# EAGLE design Senior_Design_2 (EAGLE 9.6.0)
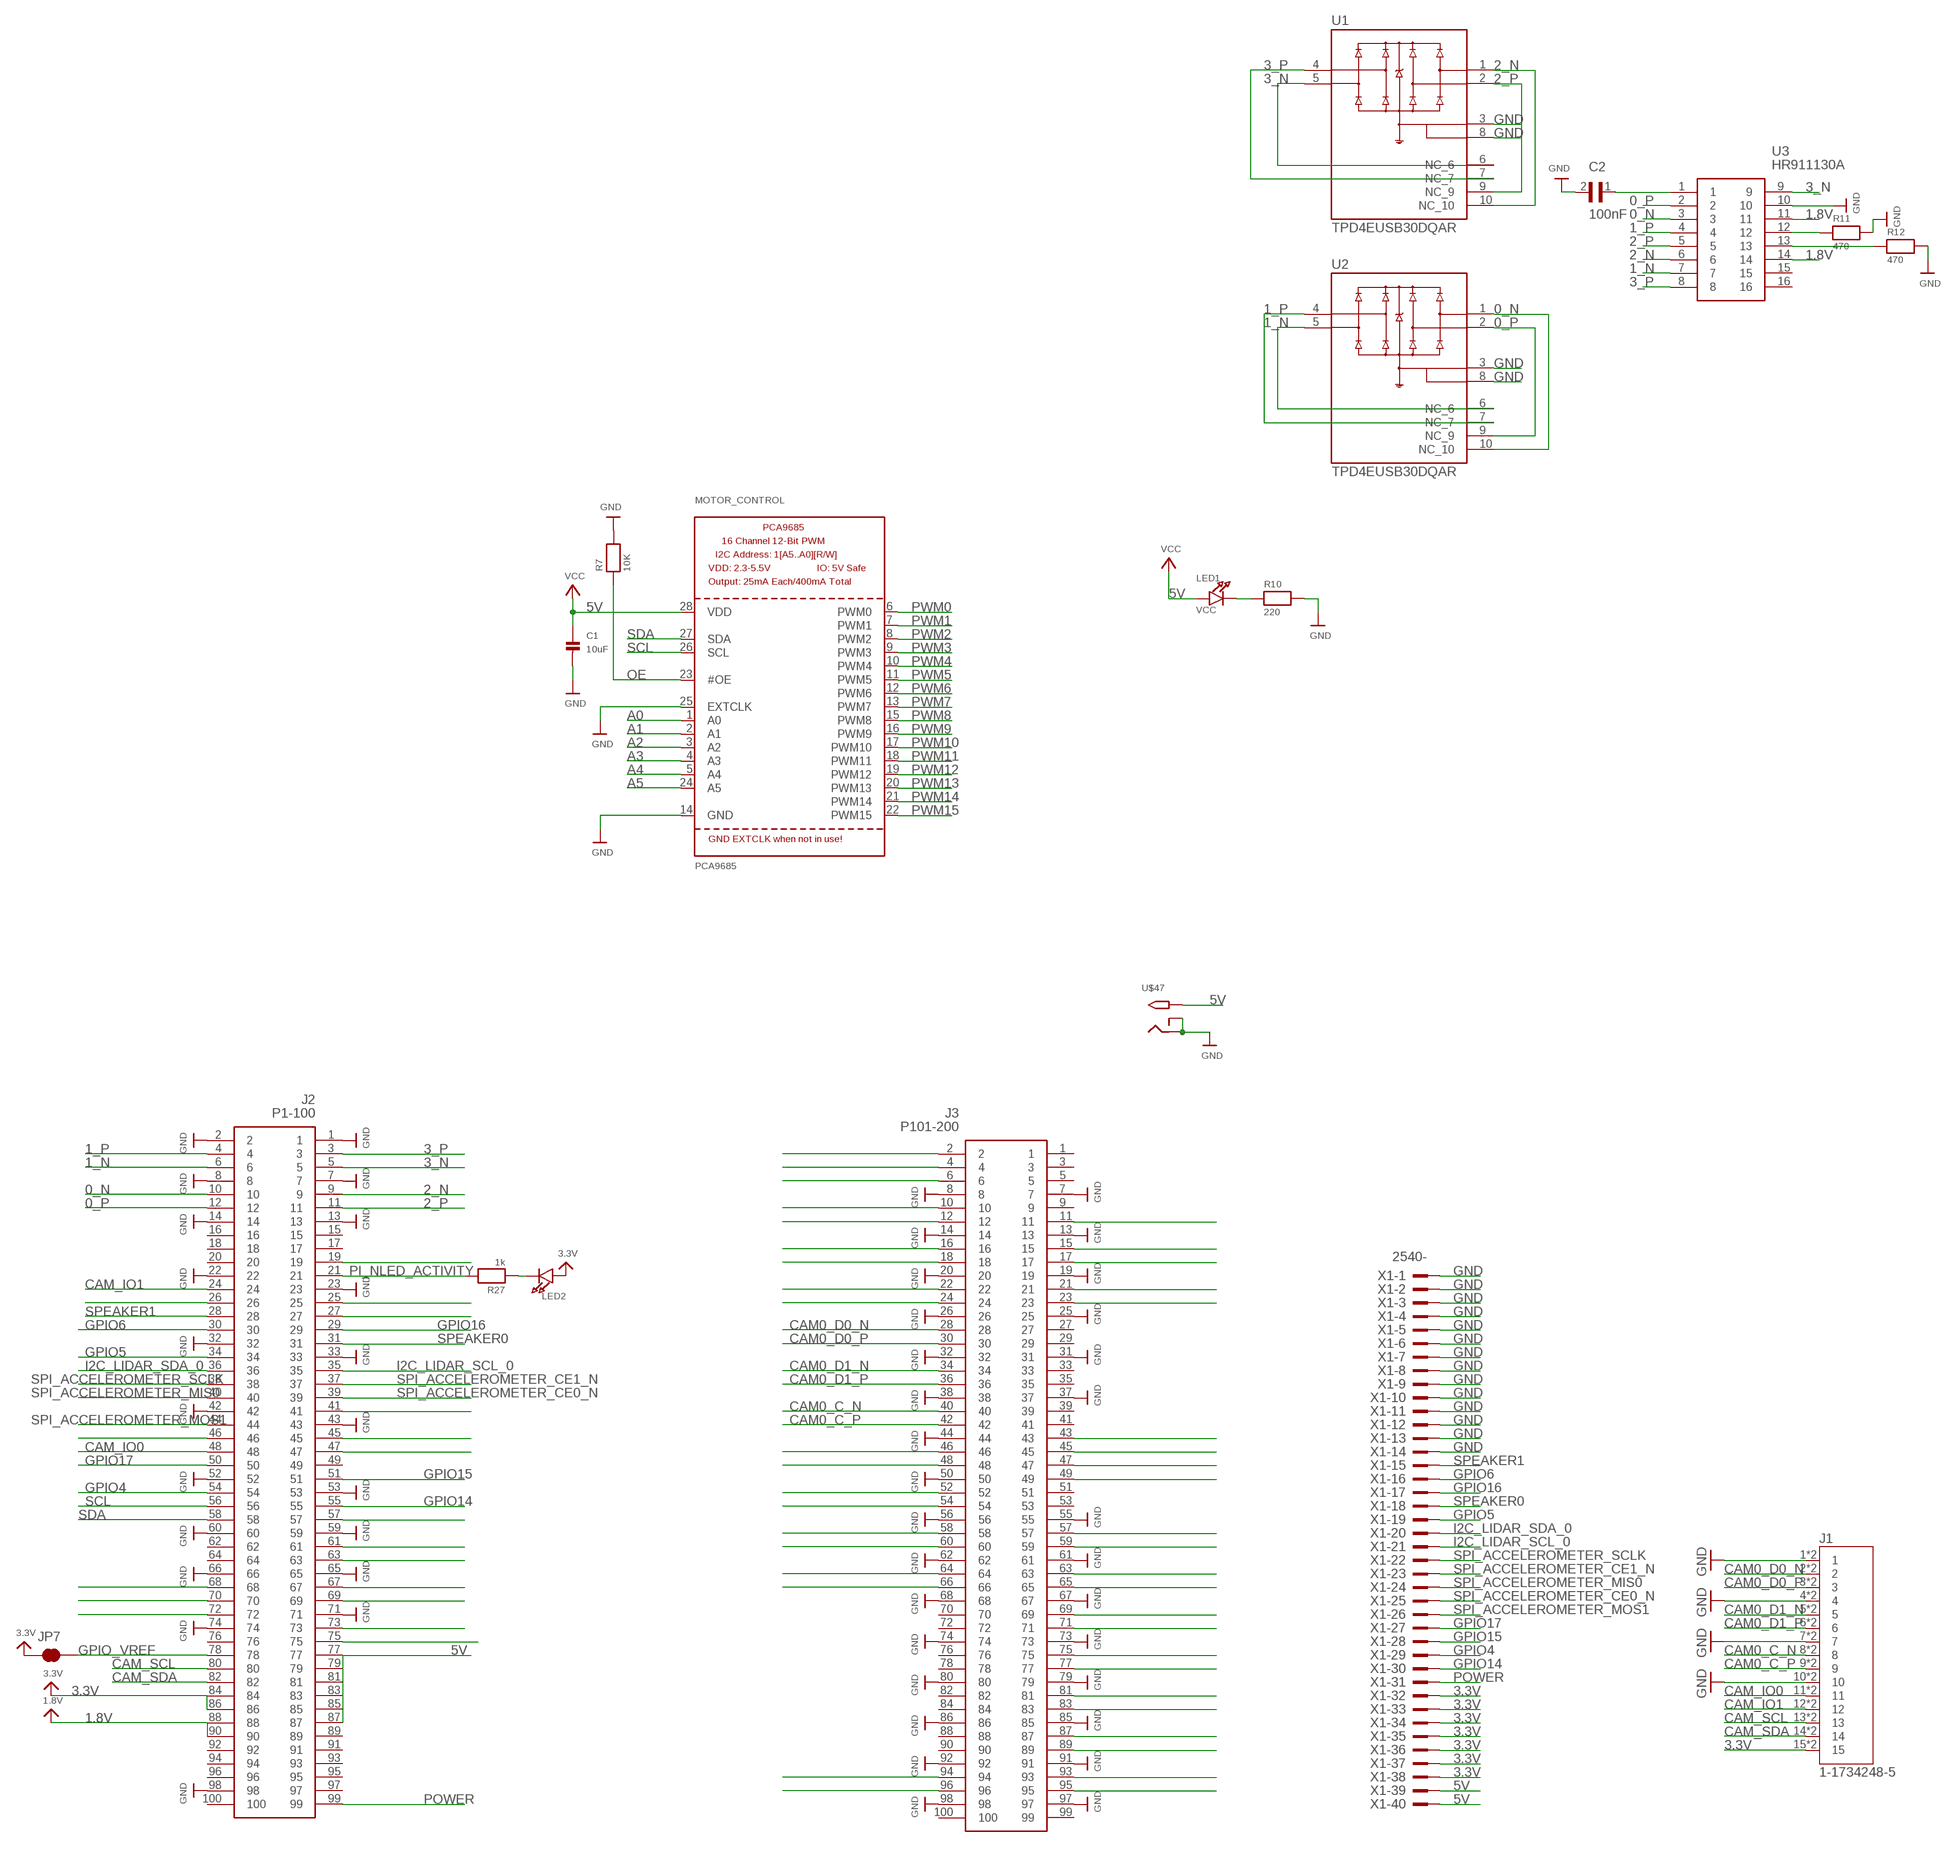
[diagram p0: schematic, sheet 1, part 1 of 2]
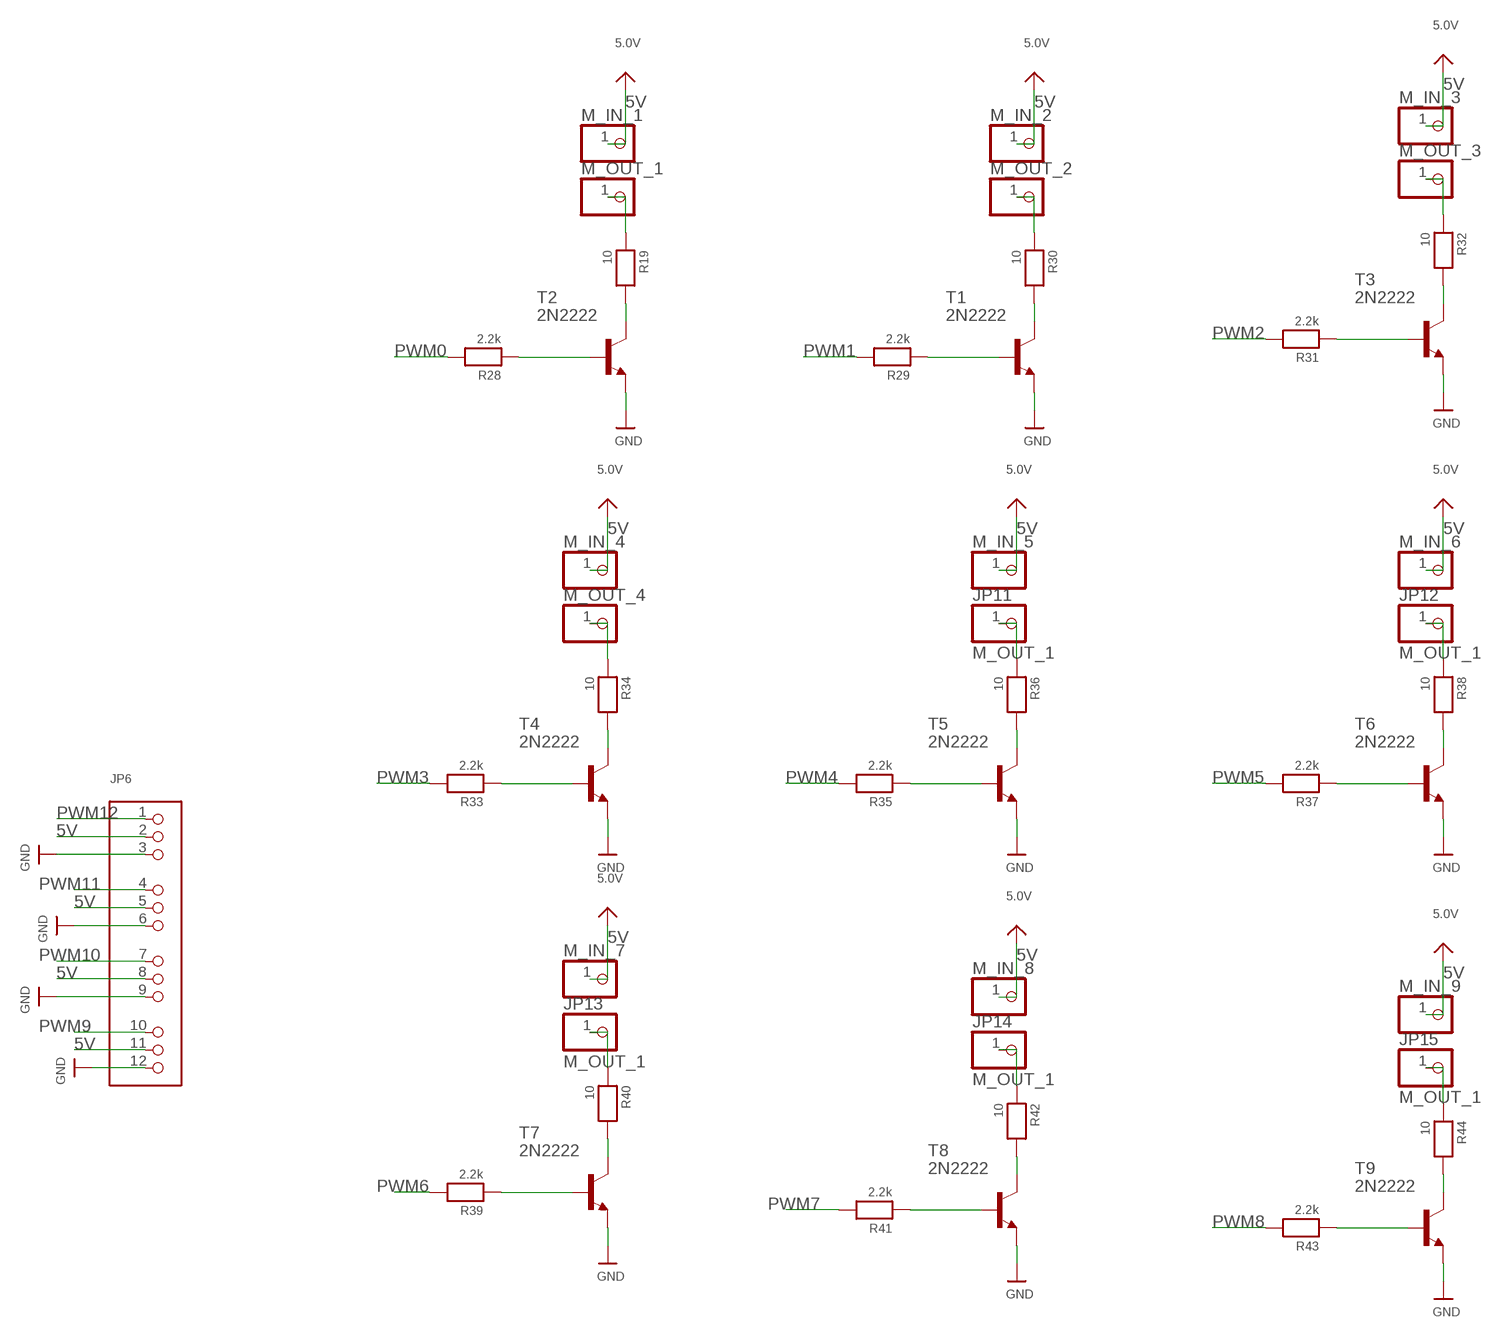
[diagram p1: schematic, sheet 1, part 2 of 2]

## Parts
C1  10uF  CAP_CERAMIC0805  [0805@1]
C2  100nF  CC0603KRX7R9BB104  [CAPC1608X90]
J1  1-1734248-5  [TE_1-1734248-5]
J2  P1-100  DF40C-100DS-0.4V_51_  [DF40C100DS04V51]
J3  P101-200  DF40C-100DS-0.4V_51_  [DF40C100DS04V51]
JP6  HEADER-3X04  [3X04]
JP7  JUMPER-SMT_2_NC_TRACE_NO-SILK  [SMT-JUMPER_2_NC_TRACE_NO-SILK]
JP11  M_OUT_1  PINHD-1X1  [1X01]
JP12  M_OUT_1  PINHD-1X1  [1X01]
JP13  M_OUT_1  PINHD-1X1  [1X01]
JP14  M_OUT_1  PINHD-1X1  [1X01]
JP15  M_OUT_1  PINHD-1X1  [1X01]
LED1  VCC  LED0805  [CHIPLED_0805]
LED2  LED0603  [CHIPLED_0603]
M_IN_1  PINHD-1X1  [1X01]
M_IN_2  PINHD-1X1  [1X01]
M_IN_3  PINHD-1X1  [1X01]
M_IN_4  PINHD-1X1  [1X01]
M_IN_5  PINHD-1X1  [1X01]
M_IN_6  PINHD-1X1  [1X01]
M_IN_7  PINHD-1X1  [1X01]
M_IN_8  PINHD-1X1  [1X01]
M_IN_9  PINHD-1X1  [1X01]
M_OUT_1  PINHD-1X1  [1X01]
M_OUT_2  PINHD-1X1  [1X01]
M_OUT_3  PINHD-1X1  [1X01]
M_OUT_4  PINHD-1X1  [1X01]
MOTOR_CONTROL  PCA9685  [TSSOP28]
R7  10K  RESISTOR0805  [0805]
R10  220  RESISTOR0805  [0805]
R11  470  RESISTOR0805  [0805]
R12  470  RESISTOR0805  [0805]
R19  10  RESISTOR0805  [0805]
R27  1k  RESISTOR0805  [0805]
R28  2.2k  RESISTOR0805  [0805]
R29  2.2k  RESISTOR0805  [0805]
R30  10  RESISTOR0805  [0805]
R31  2.2k  RESISTOR0805  [0805]
R32  10  RESISTOR0805  [0805]
R33  2.2k  RESISTOR0805  [0805]
R34  10  RESISTOR0805  [0805]
R35  2.2k  RESISTOR0805  [0805]
R36  10  RESISTOR0805  [0805]
R37  2.2k  RESISTOR0805  [0805]
R38  10  RESISTOR0805  [0805]
R39  2.2k  RESISTOR0805  [0805]
R40  10  RESISTOR0805  [0805]
R41  2.2k  RESISTOR0805  [0805]
R42  10  RESISTOR0805  [0805]
R43  2.2k  RESISTOR0805  [0805]
R44  10  RESISTOR0805  [0805]
T1  2N2222  [TO92-EBC-OVAL]
T2  2N2222  [TO92-EBC-OVAL]
T3  2N2222  [TO92-EBC-OVAL]
T4  2N2222  [TO92-EBC-OVAL]
T5  2N2222  [TO92-EBC-OVAL]
T6  2N2222  [TO92-EBC-OVAL]
T7  2N2222  [TO92-EBC-OVAL]
T8  2N2222  [TO92-EBC-OVAL]
T9  2N2222  [TO92-EBC-OVAL]
U1  TPD4EUSB30DQAR  [IC_TPD4EUSB30DQAR]
U2  TPD4EUSB30DQAR  [IC_TPD4EUSB30DQAR]
U3  HR911130A  [HR911130A]
U$47  2.1MMJACKTHM  [PJ-102A]
X1  2540-  [PAK100/2500-40]

## Nets
0_N: J2.10 U2.1(D1+) U2.10(NC_10) U3.3
0_P: J2.12 U2.2(D1-) U2.9(NC_9) U3.2
1.8V: J2.88 J2.90 U3.11 U3.14
1_N: J2.6 U2.5(D2-) U2.6(NC_6) U3.7
1_P: J2.4 U2.4(D2+) U2.7(NC_7) U3.4
2_N: J2.9 U1.1(D1+) U1.10(NC_10) U3.6
2_P: J2.11 U1.2(D1-) U1.9(NC_9) U3.5
3.3V: J1.15 J1.15_1 J2.84 J2.86 JP7.1 LED2.A X1.32 X1.33 X1.34 X1.35 X1.36 X1.37 X1.38
3_N: J2.5 U1.5(D2-) U1.6(NC_6) U3.9
3_P: J2.3 U1.4(D2+) U1.7(NC_7) U3.8
5V: C1.1 J2.77 J2.79 J2.81 J2.83 J2.85 J2.87 JP6.2 JP6.5 JP6.8 JP6.11 LED1.A M_IN_1.1 M_IN_2.1 M_IN_3.1 M_IN_4.1 M_IN_5.1 M_IN_6.1 M_IN_7.1 M_IN_8.1 M_IN_9.1 MOTOR_CONTROL.28(VDD) U$47.TIP X1.39 X1.40 ; supply symbol labelled VCC, 5.0V
A0: MOTOR_CONTROL.1(A0)
A1: MOTOR_CONTROL.2(A1)
A2: MOTOR_CONTROL.3(A2)
A3: MOTOR_CONTROL.4(A3)
A4: MOTOR_CONTROL.5(A4)
A5: MOTOR_CONTROL.24(A5)
CAM0_C_N: J1.8 J1.8_1 J3.40
CAM0_C_P: J1.9 J1.9_1 J3.42
CAM0_D0_N: J1.2 J1.2_1 J3.28
CAM0_D0_P: J1.3 J1.3_1 J3.30
CAM0_D1_N: J1.5 J1.5_1 J3.34
CAM0_D1_P: J1.6 J1.6_1 J3.36
CAM_IO0 [CAMIO]: J1.11 J1.11_1 J2.48
CAM_IO1 [CAMIO]: J1.12 J1.12_1 J2.24
CAM_SCL: J1.13 J1.13_1 J2.80
CAM_SDA: J1.14 J1.14_1 J2.82
GND: C1.2 C2.2 J1.1 J1.1_1 J1.4 J1.4_1 J1.7 J1.7_1 J1.10 J1.10_1 J2.1 J2.2 J2.7 J2.8 J2.13 J2.14 J2.22 J2.23 J2.32 J2.33 J2.42 J2.43 J2.52 J2.53 J2.59 J2.60 J2.65 J2.66 J2.71 J2.74 J2.98 J3.7 J3.8 J3.13 J3.14 J3.19 J3.20 J3.25 J3.26 J3.31 J3.32 J3.37 J3.38 J3.44 J3.50 J3.55 J3.56 J3.61 J3.62 J3.67 J3.68 J3.73 J3.74 J3.79 J3.80 J3.85 J3.86 J3.91 J3.92 J3.97 J3.98 JP6.3 JP6.6 JP6.9 JP6.12 MOTOR_CONTROL.14(GND) MOTOR_CONTROL.25(EXTCLK) R7.2 R10.2 R11.2 R12.2 T1.E T2.E T3.E T4.E T5.E T6.E T7.E T8.E T9.E U1.3(GND_3) U1.8(GND_8) U2.3(GND_3) U2.8(GND_8) U3.10 U$47.RING U$47.RING_SW X1.1 X1.2 X1.3 X1.4 X1.5 X1.6 X1.7 X1.8 X1.9 X1.10 X1.11 X1.12 X1.13 X1.14
GPIO4: J2.54 X1.29
GPIO5: J2.34 X1.19
GPIO6: J2.30 X1.16
GPIO14: J2.55 X1.30
GPIO15: J2.51 X1.28
GPIO16: J2.29 X1.17
GPIO17: J2.50 X1.27
GPIO_VREF: J2.78 JP7.2
I2C_LIDAR_SCL_0: J2.35 X1.21
I2C_LIDAR_SDA_0: J2.36 X1.20
N$1: LED1.C R10.1
N$2: C2.1 U3.1
N$3: R11.1 U3.12
N$4: R12.1 U3.13
N$17: R19.2 T2.C
N$18: LED2.C R27.1
N$19: J2.19
N$20: J3.2
N$21: J3.4
N$22: J3.6
N$23: R28.1 T2.B
N$24: J3.10
N$25: J2.25
N$26: J3.11
N$27: J2.27
N$28: J3.12
N$31: J3.15
N$32: J3.16
N$33: J3.17
N$34: M_OUT_1.1 R19.1
N$35: J3.18
N$36: J3.21
N$37: J3.22
N$38: R29.1 T1.B
N$39: R30.2 T1.C
N$40: M_OUT_2.1 R30.1
N$41: J2.41
N$42: J3.23
N$43: J3.24
N$44: R31.1 T3.B
N$45: J2.45
N$46: J2.46
N$47: J2.47
N$48: R32.2 T3.C
N$49: M_OUT_3.1 R32.1
N$50: R33.1 T4.B
N$51: R34.2 T4.C
N$52: M_OUT_4.1 R34.1
N$54: R35.1 T5.B
N$55: R36.2 T5.C
N$56: J2.57
N$57: JP11.1 R36.1
N$58: R37.1 T6.B
N$59: R38.2 T6.C
N$61: JP12.1 R38.1
N$63: R39.1 T7.B
N$66: R40.2 T7.C
N$68: J2.68
N$70: J2.70
N$72: J2.72
N$73: JP13.1 R40.1
N$74: R41.1 T8.B
N$76: R42.2 T8.C
N$78: J3.43
N$81: J3.45
N$82: JP14.1 R42.1
N$83: J3.46
N$84: J3.47
N$85: J3.48
N$86: J3.49
N$89: R43.1 T9.B
N$90: J3.52
N$91: R44.2 T9.C
N$93: J3.54
N$94: JP15.1 R44.1
N$99: J3.57
N$100: J3.58
N$101: J3.59
N$102: J3.60
N$105: J3.63
N$106: J3.64
N$107: J3.65
N$108: J3.66
N$110: J2.75
N$111: J3.69
N$112: J2.73
N$113: J3.71
N$114: J2.67
N$115: J2.69
N$116: J2.63
N$117: J3.75
N$118: J2.61
N$119: J3.77
N$121: J2.26
N$123: J3.81
N$125: J3.83
N$129: J3.87
N$131: J3.89
N$135: J3.93
N$136: J3.94
N$137: J3.95
N$138: J3.96
OE: MOTOR_CONTROL.23(#OE) R7.1
PI_NLED_ACTIVITY: J2.21 R27.2
POWER: J2.99 X1.31
PWM0: MOTOR_CONTROL.6(PWM0) R28.2
PWM1: MOTOR_CONTROL.7(PWM1) R29.2
PWM2: MOTOR_CONTROL.8(PWM2) R31.2
PWM3: MOTOR_CONTROL.9(PWM3) R33.2
PWM4: MOTOR_CONTROL.10(PWM4) R35.2
PWM5: MOTOR_CONTROL.11(PWM5) R37.2
PWM6: MOTOR_CONTROL.12(PWM6) R39.2
PWM7: MOTOR_CONTROL.13(PWM7) R41.2
PWM8: MOTOR_CONTROL.15(PWM8) R43.2
PWM9: JP6.10 MOTOR_CONTROL.16(PWM9)
PWM10: JP6.7 MOTOR_CONTROL.17(PWM10)
PWM11: JP6.4 MOTOR_CONTROL.18(PWM11)
PWM12: JP6.1 MOTOR_CONTROL.19(PWM12)
PWM13: MOTOR_CONTROL.20(PWM13)
PWM14: MOTOR_CONTROL.21(PWM14)
PWM15: MOTOR_CONTROL.22(PWM15)
SCL: J2.56 MOTOR_CONTROL.26(SCL)
SDA: J2.58 MOTOR_CONTROL.27(SDA)
SPEAKER0: J2.31 X1.18
SPEAKER1: J2.28 X1.15
SPI_ACCELEROMETER_CE0_N: J2.39 X1.25
SPI_ACCELEROMETER_CE1_N: J2.37 X1.23
SPI_ACCELEROMETER_MIS0: J2.40 X1.24
SPI_ACCELEROMETER_MOS1: J2.44 X1.26
SPI_ACCELEROMETER_SCLK: J2.38 X1.22
Unconnected: J2.15 J2.16 J2.17 J2.18 J2.20 J2.49 J2.62 J2.64 J2.76 J2.89 J2.91 J2.92 J2.93 J2.94 J2.95 J2.96 J2.97 J2.100 J3.1 J3.3 J3.5 J3.9 J3.27 J3.29 J3.33 J3.35 J3.39 J3.41 J3.51 J3.53 J3.70 J3.72 J3.76 J3.78 J3.82 J3.84 J3.88 J3.90 J3.99 J3.100 U3.15 U3.16

## Library data of the parts
C1 = microbuilder:CAP_CERAMIC: Ceramic Capacitors 0402 - 0402 Surface Mount Capacitors 16pF 50V 5% [Digikey: 445-4899-2-ND] 18pF 50V 5% [Digikey: 490-1281-2-ND] 22pF 50V 5% [Digikey: 490-1283-2-ND] 68pF 50V 5% [Digikey: 490-1289-2-ND] 0.1uF 10V 10% [Digikey: 490-1318-2-ND] 1.0uF 6.3V 10% [Digikey: 490-1320-2-ND] 0603 - 0603 Surface Mount Capacitors 16 pF 50V 5% [Digikey: 445-5051-2-ND] 22 pF 50V [Digikey: PCC220ACVTR-ND] 33 pF 50V 5% [Digikey: 490-1415-1-ND] 56pF 50V 5% [Digikey: 490-1421-1-ND] 220pF 50V 5% [Digikey: 445-1285-1-ND] 680 pF 50V 2200 pF 50V 5% C0G [Digikey: 445-1297-1-ND] 5600 pF 100V 5% X7R [Digikey: 478-3711-1-ND] 0.1 µF 25V 10% [Digikey: PCC2277TR-ND] 0.22 µF 16V 10% X7R [Digikey: 445-1318-1-ND] 1.0 µF 25V 10% [Digikey: 445-5146-2-ND] 0603 - RF Specific 3pF 250V +/-0.1pF RF [Digikey: 712-1347-1-ND] 18 pF 250V 5% [Digikey: 478-3505-1-ND or 712-1322-1-ND] 56 pF 250V 5% C0G RF [Digikey: 490-4867-1-ND] 68 pF 250V RF [Digikey: 490-4868-1-ND] 0805 - 0805 Surface Mount Capacitors 220 pF 250V 2% RF Ceramic Capacitor [Digikey: 712-1398-1-ND] 1000 pF 50V 2% NP0 Ceramic Capacitor [Digikey: 478-3760-1-ND] 0.1 µF 25V 10% Ceramic Capacitor [Digikey: PCC1828TR-ND] 1.0 µF 16V 10% Ceramic Capacitor[Digikey: 490-1691-2-ND] 10.0 µF 10V 10% Ceramic Capacitor[Digikey: 709-1228-1-ND] 10.0 uF 16V 10% Ceramic Capacitor [Digikey: 478-5165-2-ND] 47 uF 6.3V 20% Ceramic Capacitor [Digikey: 587-1779-1-ND or 399-5506-1-ND] 1206 - 1206 Surface Mount Capacitors 47uF 10V 20% Ceramic Capacitor [Digikey: 490-5528-1-ND or 399-5508-1-ND or 445-6010-1-ND] 100uF 6.3V -20%, +80% Y5V Ceramic Capacitor (Digikey: 490-4512-1-ND, Mouser: 81-GRM31CF50J107ZE1L)
C2 = CC0603KRX7R9BB104:CC0603KRX7R9BB104: CAPACITOR, 0603, 100NF, 50V, X7R; Dielectric Characteristic:X7R; Capacitance:100000pF; Capacitance Tolerance:± 10%; Voltage Rating:50V; Temperature Coefficient:± 15%; Capacitor Case Style:0603; No. of Pins:2; Mounting Type:SMD; Operating Temperature Range:-55°C to +125°C; SVHC:No SVHC; Application:Standard; Capacitor Dielectric Type:Multilayer Ceramic; Case Style:0603; Max Operating Temperature:125°C; Min Temperature Operating:-55°C; Terminal Type:Surface Mount (SMD, SMT); Termination Type:SMD; Tolerance, +:10%; Tolerance, -:10%; Voltage Rating DC:50V Check availability <https://pricing.snapeda.com/parts/CC0603KRX7R9BB104/Yageo/view-part?ref=eda>; AVAILABILITY: In Stock; DESCRIPTION: 0.1 µF ±10% 50V Ceramic Capacitor X7R 0603 (1608 Metric); MF: Yageo; MP: CC0603KRX7R9BB104; PACKAGE: 0603 Yageo; PRICE: None; PURCHASE-URL: https://pricing.snapeda.com/search/part/CC0603KRX7R9BB104/?ref=eda
J1 = 1-1734248-5:1-1734248-5: CONN FPC VERT 15POS 1.00MM SMD; COMMENT: 1-1734248-5; DESCRIPTION: FPC CONNECTOR, RECEPTACLE 15POS 1MMPITCH; Series:FPC; Gender:Receptacle; Pitch S; DIGI-KEY_PART_NUMBER: A101418TR-ND; MF: TE Connectivity; MP: 1-1734248-5; PACKAGE: None; PURCHASE-URL: https://pricing.snapeda.com/search/part/1-1734248-5/?ref=eda
J2 = SamacSys_Parts:DF40C-100DS-0.4V_51_: HIROSE(HRS) - DF40C-100DS-0.4V(51) - CONNECTOR, STACKING, RCPT, 100POS, 2ROW Source: Datasheet <https://www.hirose.com/product/en/download_file/key_name/DF40C-100DS-0.4V(51)/category/Drawing (2D)/doc_file_id/46856/?file_category_id=6&item_id=06844033451&is_series=>; DESCRIPTION: HIROSE(HRS) - DF40C-100DS-0.4V(51) - CONNECTOR, STACKING, RCPT, 100POS, 2ROW; HEIGHT: 1.65mm; MANUFACTURER_NAME: Hirose; MANUFACTURER_PART_NUMBER: DF40C-100DS-0.4V(51); MF: VISHAY; MOUSER_PART_NUMBER: 798-DF40C100DS0.4V51; MOUSER_PRICE-STOCK: https://www.mouser.co.uk/ProductDetail/Hirose-Connector/DF40C-100DS-04V51?qs=eDUdFcBPps2MEwbnuPvZzQ%3D%3D; MPN: MCW0406MD1003BP100; OC_NEWARK: 31W9017
J3 = SamacSys_Parts:DF40C-100DS-0.4V_51_: HIROSE(HRS) - DF40C-100DS-0.4V(51) - CONNECTOR, STACKING, RCPT, 100POS, 2ROW Source: Datasheet <https://www.hirose.com/product/en/download_file/key_name/DF40C-100DS-0.4V(51)/category/Drawing (2D)/doc_file_id/46856/?file_category_id=6&item_id=06844033451&is_series=>; DESCRIPTION: HIROSE(HRS) - DF40C-100DS-0.4V(51) - CONNECTOR, STACKING, RCPT, 100POS, 2ROW; HEIGHT: 1.65mm; MANUFACTURER_NAME: Hirose; MANUFACTURER_PART_NUMBER: DF40C-100DS-0.4V(51); MOUSER_PART_NUMBER: 798-DF40C100DS0.4V51; MOUSER_PRICE-STOCK: https://www.mouser.co.uk/ProductDetail/Hirose-Connector/DF40C-100DS-04V51?qs=eDUdFcBPps2MEwbnuPvZzQ%3D%3D; OC_NEWARK: unknown
JP6 = microbuilder:HEADER-3X04
JP7 = SparkFun-Jumpers:JUMPER-SMT_2_NC_TRACE: Normally closed trace jumper This jumper has a trace between two pads so it's normally closed (NC). Use a razor knife to open the connection. For best results follow the IPC guidelines for cutting traces: Cutout at least 0.063 mm (0.005 in). Remove all loose material to clean up the cut area. Seal the cut with an approved epoxy. Reapply solder to reclose the connection.; OC_NEWARK: unknown
JP11-JP15 M_IN_1-M_IN_9 M_OUT_1-M_OUT_4 = pinhead:PINHD-1X1: PIN HEADER
LED1 = microbuilder:LED: LED 0603 - 0603 Surface Mount Package 2mA: Green LED - Low Power (3.9mcd, 2ma, 1.7Vf) - Digikey: 475-2709-2-ND Orange LED - Low Power (9.8mcd, 2ma, 1.8Vf) - Digikey: 475-1194-2-ND Red LED - Low Power (5mcd, 2ma, 1.8Vf) - Digikey: 475-1195-2-ND Yellow LED - Low Power (7mcd, 2ma, 1.8Vf) - Digikey: 475-1196-2-ND 5mA: Blue LED - Low Power (17mcd, 5ma, 2.9Vf) - Digikey: LNJ937W8CRACT-ND 0805 - 0805 Surface Mount Package 2mA: Red LED (8.8mcd, 2mA, 1.8Vf, Clear) - Low Power [Digikey: 475-2510-1-ND] Green LED (5mcd, 2mA, 1.8Vf, Clear) - Low Power [Digikey: 475-2730-1-ND] Yellow LED (11.3mcd, 2mA, 1.8Vf, Clear) - Low Power [Digikey: 475-2555-1-ND] 20mA: Red LED (104mcd, 20mA, Diffused) - LS R976 [Digikey: 475-1278-6-ND] Red LED (12mcd, 20mA, 2.0Vf, Clear) - APT2012EC [Digikey: 754-1128-1-ND] Green LED (15mcd, 20mA, 2.2Vf, Clear) - APT2012GC [Digikey: 754-1131-1-ND] Orange LED (160mcd, 20mA, 2.1Vf, Clear) - APT2012SECK [Digikey: 754-1130-1-ND] 1206 - 1206 Surface Mount Package Green LED (26mcd, 20mA, Diffused) - LG N971 [Digikey: 475-1407-6-ND] Red LED (15mcd, 20mA, Diffused) - LH N974 [Digikey: 475-1416-6-ND]
LED2 = microbuilder:LED: LED 0603 - 0603 Surface Mount Package 2mA: Green LED - Low Power (3.9mcd, 2ma, 1.7Vf) - Digikey: 475-2709-2-ND Orange LED - Low Power (9.8mcd, 2ma, 1.8Vf) - Digikey: 475-1194-2-ND Red LED - Low Power (5mcd, 2ma, 1.8Vf) - Digikey: 475-1195-2-ND Yellow LED - Low Power (7mcd, 2ma, 1.8Vf) - Digikey: 475-1196-2-ND 5mA: Blue LED - Low Power (17mcd, 5ma, 2.9Vf) - Digikey: LNJ937W8CRACT-ND 0805 - 0805 Surface Mount Package 2mA: Red LED (8.8mcd, 2mA, 1.8Vf, Clear) - Low Power [Digikey: 475-2510-1-ND] Green LED (5mcd, 2mA, 1.8Vf, Clear) - Low Power [Digikey: 475-2730-1-ND] Yellow LED (11.3mcd, 2mA, 1.8Vf, Clear) - Low Power [Digikey: 475-2555-1-ND] 20mA: Red LED (104mcd, 20mA, Diffused) - LS R976 [Digikey: 475-1278-6-ND] Red LED (12mcd, 20mA, 2.0Vf, Clear) - APT2012EC [Digikey: 754-1128-1-ND] Green LED (15mcd, 20mA, 2.2Vf, Clear) - APT2012GC [Digikey: 754-1131-1-ND] Orange LED (160mcd, 20mA, 2.1Vf, Clear) - APT2012SECK [Digikey: 754-1130-1-ND] 1206 - 1206 Surface Mount Package Green LED (26mcd, 20mA, Diffused) - LG N971 [Digikey: 475-1407-6-ND] Red LED (15mcd, 20mA, Diffused) - LH N974 [Digikey: 475-1416-6-ND]; MF: OSRAM; MPN: LS Q976-NR-1; OC_NEWARK: 32AC1319
MOTOR_CONTROL = microbuilder:PCA9685: PCA9685 - 16 Channel 12-Bit I2C PWM Controller 5.0V tolerant 16 channel, 12-bit I2C PWM controller with 25mA per output (max. 400mA total) Digikey: 568-5931-1-ND
R7 R10-R12 R19 R27-R44 = microbuilder:RESISTOR: Resistors For new designs, use the packages preceded by an '_' character since they are more reliable: The following footprints should be used on most boards: _0402 - Standard footprint for regular board layouts _0603 - Standard footprint for regular board layouts _0805 - Standard footprint for regular board layouts For extremely tight-pitch boards where space is at a premium, the following 'micro-pitch' footprints can be used (smaller pads, no silkscreen outline, etc.): _0402MP - Micro-pitch footprint for very dense/compact boards _0603MP - Micro-pitch footprint for very dense/compact boards _0805MP - Micro-pitch footprint for very dense/compact boards
T1-T9 = adafruit:2N2222: NPN TRANSISTOR Big oval pads
U1 U2 = TPD4EUSB30DQAR:TPD4EUSB30DQAR: 4-channel ESD solution for SuperSpeed (6 Gbps) USB 3.0 interface 10-USON -40 to 85 Check availability <https://pricing.snapeda.com/parts/TPD4EUSB30DQAR/Texas%20Instruments/view-part?ref=eda>; AVAILABILITY: In Stock; DESCRIPTION: Quad 0.8-pF, 5.5-V, ±8-kV ESD protection diode with 5-A 8/20-uS surge rating for USB 3.0; MF: Texas Instruments; MP: TPD4EUSB30DQAR; PACKAGE: USON-10 Texas Instruments; PRICE: None; PURCHASE-URL: https://pricing.snapeda.com/search/part/TPD4EUSB30DQAR/?ref=eda
U3 = HR911130A:HR911130A: SINGLE PORT RJ45 CONNECTOR WITH INTEGRATED MAGNETICS AND LED Source: Datasheet <https://datasheet.lcsc.com/szlcsc/Zhongshan-HanRun-Elec-HR911130A_C54408.pdf>; DESCRIPTION: SINGLE PORT RJ45 CONNECTOR WITH INTEGRATED MAGNETICS AND LED; HEIGHT: 13mm; MANUFACTURER_NAME: Hanrun Electronics; MANUFACTURER_PART_NUMBER: HR911130A
U$47 = adafruit:2.1MMJACK: 2.1mm x 5.5mm THM DC jack with internal switch. Digikey part #PJ-102A, 4UCON part #05537 2.1mm x 5.5mm SMT DC jack with internal switch. Digikey part #PJ-002A-SMT, 4UCON part #03267 By microbuilder.eu & adafruit.com
X1 = con-3m:2540-: 3M (TM) Pak 100 4-Wall Header Source: 3M; OC_FARNELL: unknown; OC_NEWARK: unknown

## Net classes
0 default: clearance 0.205 mm
2 CAMIO: clearance 0.205 mm to class 0, clearance 0.205 mm to class 1, clearance 0.205 mm

## Board
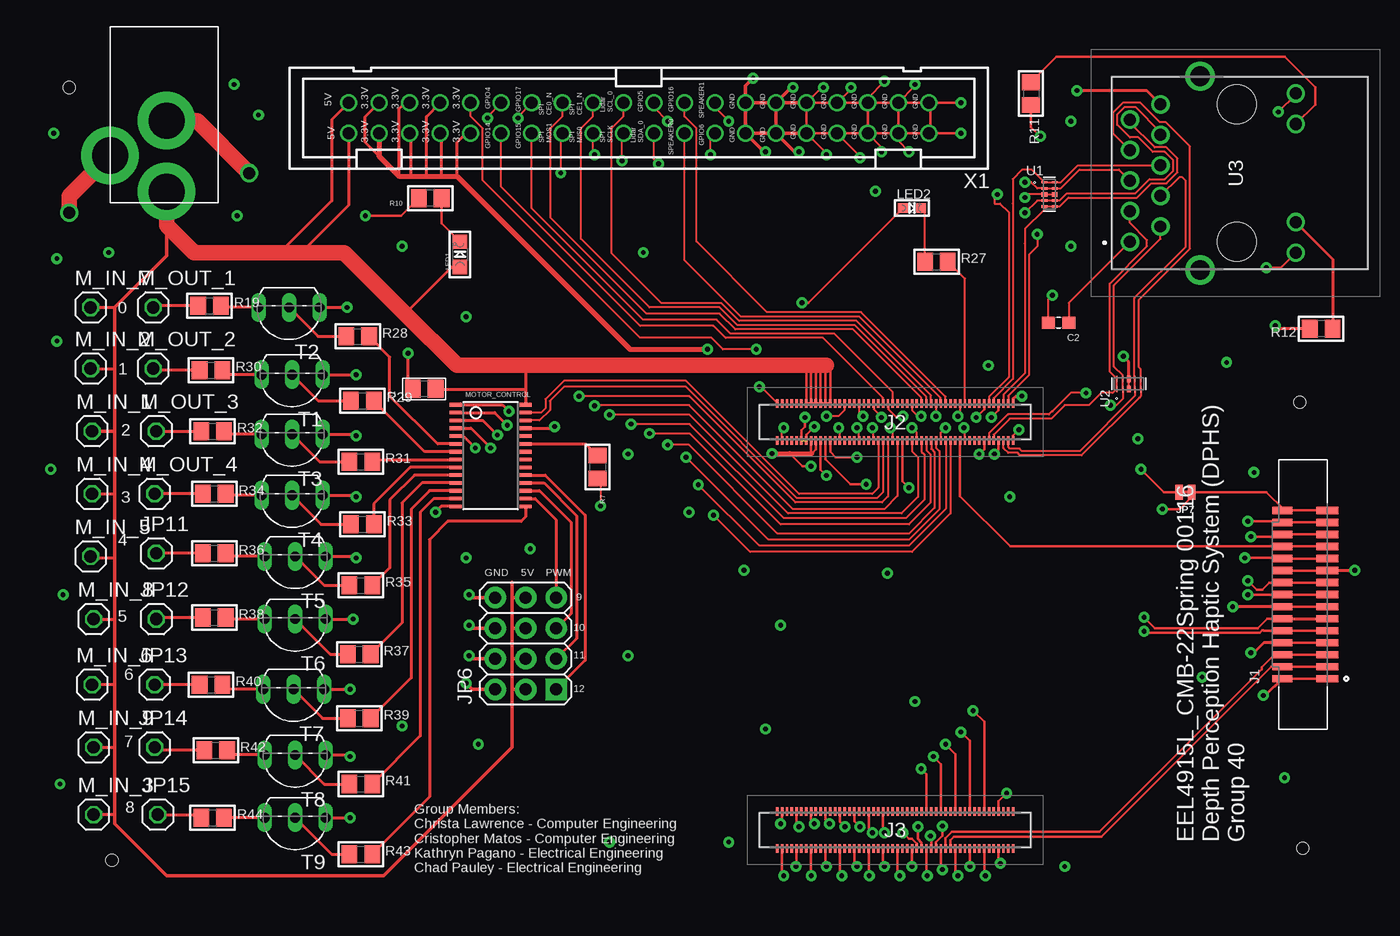
[diagram p2: board, top side]
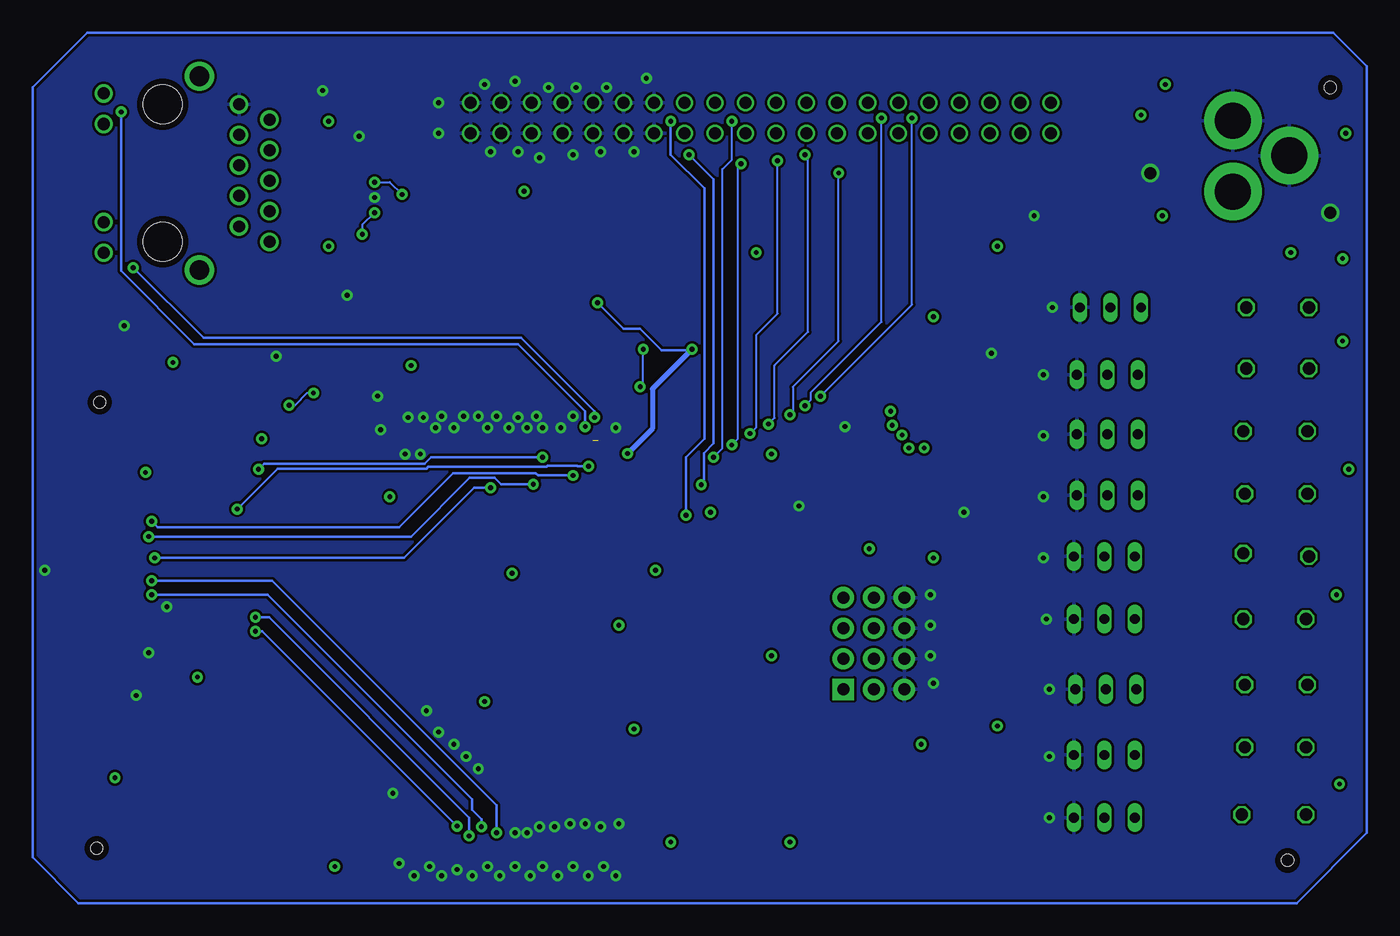
[diagram p3: board, bottom side, seen from below]

No outline drawn. Coordinates in mm, seen from the top.
Copper layers (1*16): Top 0.035mm / dielectric 1.5mm / Bottom 0.035mm
Design rules "PCBCart-Standard *": minimum track width 5mil, minimum drill 0.4mm, track to track 5mil, track to pad 8mil, pad to pad 5mil, via to via 10mil, smd to smd 6mil, copper to edge 20mil, drill to drill 8mil, minimum pad ring 8mil, minimum via ring 10mil, stop-mask expansion 3mil, vias tented up to drill 20mil, thermal gap 8mil
Holes 1 mm at 5.08,67.06 107.7,3.81 107.44,40.89 8.64,2.79

### Footprints (pad centres in the part's own frame; a part is rotated, then mirrored left to right if it is on the bottom)
0805@1 = smd 1.3 x 1.5: 1 -0.95,0; 2 0.95,0
CAPC1608X90 = smd 1.1 x 1: 1 -0.85,0; 2 0.85,0
TE_1-1734248-5 = smd 0.6 x 1.85: 1 -7,-2.025; 2 -6,-2.025; 3 -5,-2.025; 4 -4,-2.025; 5 -3,-2.025; 6 -2,-2.025; 7 -1,-2.025; 8 0,-2.025; 9 1,-2.025; 10 2,-2.025; 11 3,-2.025; 12 4,-2.025; 13 5,-2.025; 14 6,-2.025; 15 7,-2.025 | smd 0.6 x 1.65: 1_1 -7,1.725; 2_1 -6,1.725; 3_1 -5,1.725; 4_1 -4,1.725; 5_1 -3,1.725; 6_1 -2,1.725; 7_1 -1,1.725; 8_1 0,1.725; 9_1 1,1.725; 10_1 2,1.725; 11_1 3,1.725; 12_1 4,1.725; 13_1 5,1.725; 14_1 6,1.725; 15_1 7,1.725
DF40C100DS04V51 = smd 0.2 x 0.7: 1 -9.8,-1.54; 2 -9.8,1.54; 3 -9.4,-1.54; 4 -9.4,1.54; 5 -9,-1.54; 6 -9,1.54; 7 -8.6,-1.54; 8 -8.6,1.54; 9 -8.2,-1.54; 10 -8.2,1.54; 11 -7.8,-1.54; 12 -7.8,1.54; 13 -7.4,-1.54; 14 -7.4,1.54; 15 -7,-1.54; 16 -7,1.54; 17 -6.6,-1.54; 18 -6.6,1.54; 19 -6.2,-1.54; 20 -6.2,1.54; 21 -5.8,-1.54; 22 -5.8,1.54; 23 -5.4,-1.54; 24 -5.4,1.54; 25 -5,-1.54; 26 -5,1.54; 27 -4.6,-1.54; 28 -4.6,1.54; 29 -4.2,-1.54; 30 -4.2,1.54; 31 -3.8,-1.54; 32 -3.8,1.54; 33 -3.4,-1.54; 34 -3.4,1.54; 35 -3,-1.54; 36 -3,1.54; 37 -2.6,-1.54; 38 -2.6,1.54; 39 -2.2,-1.54; 40 -2.2,1.54; 41 -1.8,-1.54; 42 -1.8,1.54; 43 -1.4,-1.54; 44 -1.4,1.54; 45 -1,-1.54; 46 -1,1.54; 47 -0.6,-1.54; 48 -0.6,1.54; 49 -0.2,-1.54; 50 -0.2,1.54; 51 0.2,-1.54; 52 0.2,1.54; 53 0.6,-1.54; 54 0.6,1.54; 55 1,-1.54; 56 1,1.54; 57 1.4,-1.54; 58 1.4,1.54; 59 1.8,-1.54; 60 1.8,1.54; 61 2.2,-1.54; 62 2.2,1.54; 63 2.6,-1.54; 64 2.6,1.54; 65 3,-1.54; 66 3,1.54; 67 3.4,-1.54; 68 3.4,1.54; 69 3.8,-1.54; 70 3.8,1.54; 71 4.2,-1.54; 72 4.2,1.54; 73 4.6,-1.54; 74 4.6,1.54; 75 5,-1.54; 76 5,1.54; 77 5.4,-1.54; 78 5.4,1.54; 79 5.8,-1.54; 80 5.8,1.54; 81 6.2,-1.54; 82 6.2,1.54; 83 6.6,-1.54; 84 6.6,1.54; 85 7,-1.54; 86 7,1.54; 87 7.4,-1.54; 88 7.4,1.54; 89 7.8,-1.54; 90 7.8,1.54; 91 8.2,-1.54; 92 8.2,1.54; 93 8.6,-1.54; 94 8.6,1.54; 95 9,-1.54; 96 9,1.54; 97 9.4,-1.54; 98 9.4,1.54; 99 9.8,-1.54; 100 9.8,1.54
3X04 = drill 1 pad 1.778 square: 1 -3.81,-2.54 | drill 1 pad 1.778: 2 -3.81,0; 3 -3.81,2.54; 4 -1.27,-2.54; 5 -1.27,0; 6 -1.27,2.54; 7 1.27,-2.54; 8 1.27,0; 9 1.27,2.54; 10 3.81,-2.54; 11 3.81,0; 12 3.81,2.54
SMT-JUMPER_2_NC_TRACE_NO-SILK = smd 0.635 x 1.27: 1 -0.508,0; 2 0.508,0
1X01 = drill 1.016 octagon: 1 0,0
CHIPLED_0805 = smd 1.2 x 1.2: A 0,-1.05; C 0,1.05
CHIPLED_0603 = smd 0.8 x 0.8: A 0,-0.75; C 0,0.75
TSSOP28 = smd 0.305 x 0.991: 1 -4.225,-2.918; 2 -3.575,-2.918; 3 -2.925,-2.918; 4 -2.275,-2.918; 5 -1.625,-2.918; 6 -0.975,-2.918; 7 -0.325,-2.918; 8 0.325,-2.918; 9 0.975,-2.918; 10 1.625,-2.918; 11 2.275,-2.918; 12 2.925,-2.918; 13 3.575,-2.918; 14 4.225,-2.918; 15 4.225,2.918; 16 3.575,2.918; 17 2.925,2.918; 18 2.275,2.918; 19 1.625,2.918; 20 0.975,2.918; 21 0.325,2.918; 22 -0.325,2.918; 23 -0.975,2.918; 24 -1.625,2.918; 25 -2.275,2.918; 26 -2.925,2.918; 27 -3.575,2.918; 28 -4.225,2.918
0805 = smd 1.3 x 1.5: 1 -0.95,0; 2 0.95,0
TO92-EBC-OVAL = drill 0.813 long: B 0,-1.27; C 2.54,-1.27; E -2.54,-1.27
IC_TPD4EUSB30DQAR = smd 0.565 x 0.2: 1 -0.417,1; 2 -0.417,0.5; 4 -0.417,-0.5; 5 -0.417,-1; 6 0.417,-1; 7 0.417,-0.5; 9 0.417,0.5; 10 0.417,1 | smd 0.565 x 0.4: 3 -0.417,0; 8 0.417,0
HR911130A = drill 0.99 pad 1.54: 1 5.715,-8.794; 2 4.445,-6.254; 3 3.175,-8.794; 4 1.905,-6.254; 5 0.635,-8.794; 6 -0.635,-6.254; 7 -1.905,-8.794; 8 -3.175,-6.254; 9 -4.445,-8.794; 10 -5.715,-6.254 | drill 1.02 pad 1.53: 11 -6.625,4.996; 12 -4.085,4.996; 13 4.085,4.996; 14 6.625,4.996 | drill 1.63 pad 2.445: 15 -8.05,-2.954; 16 8.05,-2.954 | hole 3.25: -5.715,0.096; 5.715,0.096
PJ-102A = drill 3 pad 4.8: RING 0.1,-3.39; RING_SW -4.6,-6.29; TIP 0.1,-9.29
PAK100/2500-40 = drill 1 pad 1.422: 1 -24.13,-1.27; 2 -24.13,1.27; 3 -21.59,-1.27; 4 -21.59,1.27; 5 -19.05,-1.27; 6 -19.05,1.27; 7 -16.51,-1.27; 8 -16.51,1.27; 9 -13.97,-1.27; 10 -13.97,1.27; 11 -11.43,-1.27; 12 -11.43,1.27; 13 -8.89,-1.27; 14 -8.89,1.27; 15 -6.35,-1.27; 16 -6.35,1.27; 17 -3.81,-1.27; 18 -3.81,1.27; 19 -1.27,-1.27; 20 -1.27,1.27; 21 1.27,-1.27; 22 1.27,1.27; 23 3.81,-1.27; 24 3.81,1.27; 25 6.35,-1.27; 26 6.35,1.27; 27 8.89,-1.27; 28 8.89,1.27; 29 11.43,-1.27; 30 11.43,1.27; 31 13.97,-1.27; 32 13.97,1.27; 33 16.51,-1.27; 34 16.51,1.27; 35 19.05,-1.27; 36 19.05,1.27; 37 21.59,-1.27; 38 21.59,1.27; 39 24.13,-1.27; 40 24.13,1.27

### Placement (x,y rotation side)
C1  34.61,41.99 180 top
C2  87.38,47.5 180 top
J1  107.7,24.89 90 top
J2  73.79,39.24 180 top
J3  73.79,5.33 180 top
JP6  43.05,20.83 90 top
JP7  97.92,33.4 180 top
JP11  12.32,28.32 0 top
JP12  12.32,22.86 0 top
JP13  12.19,17.4 0 top
JP14  12.19,12.19 0 top
JP15  12.45,6.6 0 top
LED1  37.59,53.18 0 top
LED2  75.18,57.02 270 top
M_IN_1  6.99,38.48 0 top
M_IN_2  6.86,43.69 0 top
M_IN_3  7.11,6.6 0 top
M_IN_4  6.99,33.27 0 top
M_IN_5  6.86,28.07 0 top
M_IN_6  6.99,17.4 0 top
M_IN_7  6.86,48.77 0 top
M_IN_8  7.11,22.86 0 top
M_IN_9  7.11,12.19 0 top
M_OUT_1  12.06,48.77 0 top
M_OUT_2  12.06,43.69 0 top
M_OUT_3  12.32,38.48 0 top
M_OUT_4  12.19,33.27 0 top
MOTOR_CONTROL  40.13,36.45 270 top
R7  49.02,35.49 270 top
R10  35.11,57.85 180 top
R11  85.09,66.55 270 top
R12  109.22,46.99 180 top
R19  16.76,48.9 0 top
R27  77.22,52.58 0 top
R28  29.08,46.35 0 top
R29  29.46,41.02 0 top
R30  16.89,43.56 0 top
R31  29.34,35.94 0 top
R32  17.02,38.48 0 top
R33  29.46,30.73 0 top
R34  17.14,33.27 0 top
R35  29.34,25.65 0 top
R36  17.14,28.32 0 top
R37  29.21,19.94 0 top
R38  17.14,22.99 0 top
R39  29.21,14.61 0 top
R40  16.89,17.4 0 top
R41  29.34,9.14 0 top
R42  17.27,11.94 0 top
R43  29.34,3.3 0 top
R44  17.02,6.35 0 top
T1  23.62,41.91 180 top
T2  23.37,47.5 180 top
T3  23.62,36.96 180 top
T4  23.62,31.88 180 top
T5  23.88,26.8 180 top
T6  23.88,21.59 180 top
T7  23.75,15.75 180 top
T8  23.88,10.29 180 top
T9  23.88,5.08 180 top
U1  86.61,58.17 0 top
U2  93.22,42.42 90 top
U3  102.11,59.94 270 top
U$47  13.08,67.69 0 top
X1  52.45,64.52 180 top

### Tracks (layer width: path | path; a pad name or v marks a point on that pad's centre or on a via)
0_N
  Top 0.152: J2.10 81.99,38.19 83.32,39.52 86.77,39.52 87.88,40.64 89.92,40.64 90.93,41.66 91.87,41.66 U2.1 U2.10 91.62,43.43 91.62,50.75 94.74,53.86 94.74,54.37 93.31,55.79 U3.3
0_P  (via drill 0.4)
  Top 0.152: v91.69,40.64 92.2,40.64 92.72,41.16 U2.2 U2.9 92.72,43.12 91.98,43.86 91.98,50.6 95.85,54.48 U3.2 | v89.66,41.66 88.39,41.66 86.87,40.13 86.83,40.13 86.58,39.88 83.18,39.88 81.59,38.29 J2.12
  Bottom 0.152: v91.69,40.64 91.19,40.64 90.17,41.66 v89.66,41.66
1.8V  (via drill 0.4)  (1 unrouted)
  Top 0.203: v104.65,52.07 105.86,52.07 U3.14 | J2.88 66.39,38.19 v67.06,38.86 | v105.66,65.02 107.1,66.46 U3.11 | J2.90 65.99,38.55 66.29,38.86 v66.29,39.62
  Bottom 0.203: v66.29,39.62 66.29,40.13 72.39,46.23 98.81,46.23 v104.65,52.07 | v67.06,38.86 67.06,40.13 72.64,45.72 99.57,45.72 105.66,51.82 v105.66,65.02
1_N
  Top 0.152: J2.6 82.79,37.08 83.19,36.67 83.97,36.67 84.17,36.47 89.28,36.47 94.08,41.27 94.22,41.41 U2.5 U2.6 94.22,43.62 94.06,43.78 94.06,49.41 98.3,53.66 98.3,62.16 96.29,64.17 95.8,64.17 94.17,65.8 92.73,65.8 91.91,64.97 91.91,63.26 U3.7
1_P
  Top 0.152: J2.4 83.19,37.18 83.34,37.03 84.13,37.03 84.33,36.83 89.14,36.83 93.72,41.41 U2.4 U2.7 93.7,42.85 93.7,49.56 97.94,53.81 97.94,59.32 97.67,59.59 97.4,59.59 U3.4
2_N
  Top 0.152: J2.9 81.99,41.23 83.58,42.83 83.58,57.38 83.57,57.4 83.57,59.44 84.33,60.2 85.17,60.2 U1.1 U1.10 87.56,59.17 88.97,60.58 U3.6
2_P  (via drill 0.4)
  Top 0.152: v84.58,59.18 85.09,59.18 85.61,58.67 U1.2 U1.9 87.57,58.67 89.12,60.22 92.4,60.22 U3.5 | v82.3,58.17 82.04,57.91 82.04,57.4 82.52,57.4 83.23,56.69 83.23,42.98 81.59,41.34 J2.11
  Bottom 0.152: v84.58,59.18 83.31,59.18 v82.3,58.17
3.3V  (via drill 0.4)
  Top 0.152: J2.86 66.8,37.69
  Top 0.203: J1.15 106.17,31.89 | 106.17,31.89 J1.15_1 | 106.17,31.89 104.66,33.4 JP7.1 98.42,32.97 97.46,32 v96.01,32 | LED2.A 66.57,49.16 v66.04,49.16 | J2.84 67.19,36.96 66.85,36.62 66.79,36.68 J2.86 | 65.02,36.62 66.09,35.56 v66.78,35.56
  Top 0.254: 30.86,61.34 29.72,62.48 29.72,64.64 X1.37 | 33.53,59.69 33.53,63.12 X1.36 | 32.51,59.69 32.51,65.28 33.02,65.79 X1.35 | 34.8,59.69 34.8,64.64 X1.33 | 36.07,59.69 36.07,63.12 X1.34 | 37.34,59.69 37.34,62.48 38.1,63.25 X1.32
  Top 0.406: X1.38 30.86,61.34 32.51,59.69 33.53,59.69 34.8,59.69 36.07,59.69 37.34,59.69 51.74,45.28 v58.19,45.28 | v63.55,36.62 65.02,36.62 66.85,36.62
  Bottom 0.203: v66.04,49.16 63.87,46.99 62.48,46.99 60.71,45.21 58.26,45.21 v58.19,45.28 | v66.78,35.56 67.69,35.56 67.74,35.61 70.18,35.61 70.28,35.51 80.11,35.51 80.27,35.36 92.66,35.36 v96.01,32
  Bottom 0.406: v58.19,45.28 61.47,42.01 61.47,38.7 v63.55,36.62
3_N
  Top 0.152: J2.5 82.79,41.52 84.56,43.29 84.56,54.08 84.58,54.1 84.58,55.3 86.2,56.91 U1.5 U1.6 87.47,57.17 88.21,57.9 93.9,57.9 95.09,59.09 96.36,59.09 97.26,60 97.26,61.16 96.36,62.07 95.36,62.07 93.31,64.12 U3.9
3_P  (via drill 0.4)
  Top 0.152: v84.58,56.64 85.6,57.66 86.19,57.66 U1.4 U1.7 87.47,57.67 88.06,58.26 93.75,58.26 94.94,59.45 96.21,59.45 96.91,60.14 96.91,61.01 96.21,61.71 95.22,61.71 94.03,62.9 93.32,62.9 92.26,63.95 92.26,64.82 92.88,65.44 93.75,65.44 95.85,63.34 U3.8 | v85.6,54.86 85.6,53.85 84.91,53.16 84.91,43.15 83.19,41.42 J2.3
  Bottom 0.152: v84.58,56.64 85.6,55.63 v85.6,54.86
5V
  Top 0.152: 37.4,52.33 LED1.A | 35.73,42.16 C1.1
  Top 0.203: J2.85 J2.87 66.39,43.78 66.55,43.94 66.79,43.7 J2.85 | J2.85 J2.83 | J2.83 J2.81 | J2.81 J2.79 | J2.79 J2.77 68.39,43.63 68.07,43.94 67.99,43.86 J2.79 | J2.81 67.59,43.66 67.31,43.94 67.19,43.82 J2.83
  Top 0.254: 43.18,43.94 43.05,43.81 43.05,41.91 | 43.05,41.91 MOTOR_CONTROL.28 | 43.05,41.91 35.99,41.91 35.73,42.16 | M_IN_7.1 8.89,48.77 | M_IN_2.1 8.89,43.69 | M_IN_4.1 8.89,33.27 | 8.89,27.94 6.99,27.94 M_IN_5.1 | M_IN_8.1 8.89,22.86 | 8.89,17.53 8.76,17.4 M_IN_6.1 | M_IN_9.1 8.89,12.19 | 8.89,6.6 M_IN_3.1 | 33.02,48.26 36.89,52.13 LED1.A | X1.40 28.32,57.26 24.38,53.32 | X1.39 26.92,64.39 26.92,57.64 22.61,53.32
  Top 0.305: 41.91,17.02 41.91,12.19 31.24,1.52 13.21,1.52 8.89,5.84 8.89,6.6 8.89,12.19 8.89,17.53 8.89,22.86 8.89,27.94 8.89,33.27 8.89,38.35 | 41.91,17.02 41.91,19.56 | 41.91,19.56 41.91,22.1 | 41.91,22.1 41.91,24.64 | 41.91,24.64 41.91,25.91 | JP6.2 41.91,17.02 | JP6.5 41.91,19.56 | JP6.8 41.91,22.1 | 41.91,24.64 JP6.11 | 8.89,38.35 8.89,43.69 8.89,48.77 13.18,53.06 13.18,55.61 | M_IN_1.1 8.76,38.48 8.89,38.35
  Top 1.27: 68.07,43.94 67.31,43.94 66.55,43.94 43.18,43.94 37.34,43.94 33.02,48.26 27.96,53.32 24.38,53.32 22.61,53.32 15.47,53.32 13.18,55.61 U$47.TIP
A0  (via drill 0.4)
  Top 0.254: MOTOR_CONTROL.1 41.12,40.67 v41.66,40.14
A1  (via drill 0.4)
  Top 0.254: MOTOR_CONTROL.2 40.48,40.02 v41.52,38.98
A2  (via drill 0.4)
  Top 0.254: MOTOR_CONTROL.3 39.48,39.37 v40.7,38.16
A3  (via drill 0.4)
  Top 0.254: MOTOR_CONTROL.4 38.49,38.72 v40.13,37.08
A4  (via drill 0.4)
  Top 0.254: MOTOR_CONTROL.5 37.87,38.07 v38.86,37.08
CAM0_C_N  (via drill 0.4)
  Top 0.203: J1.8 J1.8_1 v103.12,24.89 | J3.40 75.99,4.28 75.69,4.57 v75.69,5.59
  Bottom 0.203: v103.12,24.89 93.47,24.89 76.45,7.87 76.45,6.99 75.69,6.22 v75.69,5.59
CAM0_C_P  (via drill 0.4)
  Top 0.203: J1.9 J1.9_1 104.92,25.89 104.33,25.3 103.88,25.3 v103.12,26.05 | v74.42,5.08 74.93,4.57 75.18,4.57 75.59,4.17 J3.42
  Bottom 0.203: v103.12,26.05 93.11,26.05 74.42,7.37 v74.42,5.08
CAM0_D0_N
  Top 0.203: J1.2 J1.2_1 105.06,18.89 90.92,4.75 78.67,4.75 78.39,4.47 J3.28
CAM0_D0_P
  Top 0.203: J1.3 J1.3_1 105.3,19.89 104.28,18.87 104.28,18.69 90.75,5.16 78.5,5.16 77.98,4.64 77.98,3.8 J3.30
CAM0_D1_N  (via drill 0.4)
  Top 0.203: J1.5 J1.5_1 104.44,21.89 104.4,21.93 104.33,21.93 104.11,21.7 94.63,21.7 v94.49,21.84 | J3.34 77.19,4.29 77.72,4.83 v77.72,5.65
  Bottom 0.203: 94.23,21.84 v94.49,21.84 93.92,21.84 v77.72,5.65
CAM0_D1_P  (via drill 0.4)
  Top 0.203: J1.6_1 104.72,22.89 103.94,22.11 95.38,22.11 v94.49,23.01 | J3.36 76.79,4.75 v76.71,4.83
  Top 0.254: J1.6_1 J1.6
  Bottom 0.203: v94.49,23.01 93.36,23.01 76.71,6.35 v76.71,4.83
CAM_IO0  (via drill 0.4)
  Top 0.203: J1.11 106.17,27.89 | 106.17,27.89 J1.11_1 | v102.87,27.94 106.12,27.94 106.17,27.89 | J2.48 74.39,34.33 v74.93,33.78
  Bottom 0.203: v102.87,27.94 82.14,27.94 76.3,33.78 v74.93,33.78
CAM_IO1
  Top 0.203: J1.12 J1.12_1 83.38,28.89 79.19,33.08 J2.24
CAM_SCL  (via drill 0.4)
  Top 0.203: J1.13 J1.13_1 105.8,29.72 v103.38,29.72 | J2.80 67.99,36.15 70.08,34.06 v71.37,34.06
  Bottom 0.203: v71.37,34.06 74.06,34.06 74.59,34.59 76.66,34.59 81.53,29.72 v103.38,29.72
CAM_SDA  (via drill 0.4)
  Top 0.203: J1.14 106.17,30.89 | 106.17,30.89 J1.14_1 | J2.82 67.59,35.28 v68.07,34.8 | v103.12,30.99 106.08,30.99 106.17,30.89
  Bottom 0.203: v68.07,34.8 70.97,34.8 71.17,35 78.03,35 82.55,30.48 102.62,30.48 v103.12,30.99
GND  (via drill 0.4, 1)
  Top 0.152: U1.8 U1.3 84.84,58.17 v84.58,57.91 | U2.3 U2.8 | C2.2 86.53,49.44 v86.87,49.78 | J2.98 64.39,38.63 v64.52,38.76 | J2.74 69.19,38.66 v69.09,38.76 | J2.66 70.79,38.59 v70.61,38.76 | J2.60 71.99,38.66 v71.88,38.76 | J2.52 73.59,38.58 v73.41,38.76 | J2.42 75.59,38.36 v75.18,38.76 | J2.32 77.59,38.37 v77.98,38.76 | J2.22 79.59,38.68 v79.5,38.76 | J2.23 79.19,39.92 v78.99,39.73 | J2.33 v77.19,39.73 | J2.43 75.19,40.23 75.69,39.73 v75.95,39.73 | J2.65 70.79,40.06 v71.12,39.73 | J2.71 69.59,40.22 69.09,39.73 v68.07,39.73 | J2.53 73.21,40.76 73.21,40.32 73.8,39.73 v74.42,39.73 | J2.59 72.01,40.76 72.01,40.32 72.64,39.68 v72.64,39.62 | R7.2 49.28,34.29 v49.28,32.26
  Top 0.203: X1.1 v79.25,65.79 | 76.71,63.25 X1.2 X1.4 | 76.71,63.25 v79.25,63.25 | X1.4 74.04,62.61 v74.93,61.72 | X1.3 75.44,67.18 v75.44,67.31 | X1.5 71.5,66.17 v72.9,67.56 | X1.5 X1.3 | X1.3 X1.1 | X1.1 76.71,65.66 76.71,63.25 | X1.4 X1.3 | X1.4 X1.6 | X1.6 X1.5 | X1.6 X1.8 | X1.8 X1.10 | X1.10 X1.9 | X1.9 66.55,65.79 X1.7 | X1.7 X1.5 | X1.7 70.1,66.93 v70.1,67.06 | X1.9 67.69,67.06 v67.82,67.06 | X1.10 68.07,61.59 v68.07,61.47 | X1.8 70.87,61.34 v70.87,61.21 | X1.6 72.64,62.1 v72.64,61.72 | J2.43 | J2.8 82.39,36.92 v82.04,36.58 | J2.14 81.19,36.99 v80.77,36.58 | J2.7 82.39,40.22 v81.79,39.62 | J2.13 81.19,40.29 v80.52,39.62 | J1.4 J1.4_1 | J1.1 J1.1_1 | J1.7 J1.7_1 | J1.10 J1.10_1 | J3.97 64.39,5.97 v64.26,5.84 | J3.91 65.59,5.79 v65.79,5.59 | J3.85 66.79,6.11 v67.06,5.84 | J3.79 67.99,6.18 v68.33,5.84 | J3.73 69.19,6 v69.6,5.59 | J3.67 70.39,6.07 v70.87,5.59 | J3.61 71.59,5.38 v71.88,5.08 | J3.55 72.79,5.19 v72.9,5.08 | J3.37 76.39,9.97 v75.95,10.41 | J3.31 77.59,10.8 v76.96,11.43 | J3.25 78.79,11.64 v77.98,12.45 | J3.19 79.99,12.72 v79.25,13.46 | J3.13 81.19,14.32 v80.26,15.24 | J3.7 82.39,7.71 v83.06,8.38 | J3.8 82.39,2.7 v82.55,2.54 | J3.14 81.19,1.62 v81.28,1.52 | J3.20 79.99,2.31 v80.01,2.29 | J3.32 77.59,2.17 v77.72,2.03 | J3.38 76.39,1.59 v76.45,1.52 | J3.44 v75.19,2.29 v75.18,2.29 | J3.50 73.99,1.71 v74.17,1.52 | J3.56 72.79,2.4 v72.9,2.29 | J3.62 71.59,1.56 v71.63,1.52 | J3.68 70.39,2.51 v70.61,2.29 | J3.74 69.19,1.68 v69.34,1.52 | J3.80 67.99,2.37 v68.07,2.29 | J3.86 66.79,1.54 v66.8,1.52 | J3.92 65.59,2.34 v65.53,2.29 | J3.98 64.39,1.65 v64.52,1.52 | J2.1 83.59,41.17 83.82,41.4 v84.33,41.4 | J2.2 83.59,38.12 v84.07,38.61 | J3.26 78.79,1.73 v78.99,1.52 | R10.2 32.7,56.39 v29.72,56.39
  Top 0.203: R11.2 85.09,63.75 v85.85,62.99
  Top 0.254: T2.E v28.19,48.77 | T1.E v28.96,43.18 | T3.E 28.83,38.23 v28.96,38.1 | T4.E 28.83,33.15 v28.96,33.02 | T5.E 28.83,28.07 v28.96,27.94 | T6.E v28.7,22.86 | T7.E v28.45,17.02 | T8.E 28.32,11.56 v28.45,11.43 | T9.E v28.45,6.35 | R12.2 105.66,46.99 v105.41,47.24 | U2.8 93.22,44.25 v92.77,44.7 | MOTOR_CONTROL.25 45.33,38.72 v45.47,38.86 | C1.2 33.27,42.37 v33.27,44.96 | MOTOR_CONTROL.14 36.03,32.22 v35.56,31.75 | J1.7_1 101.87,23.89 v101.85,23.88 | J1.4_1 104.46,20.89 103.63,20.07 v103.38,20.07 | J1.1_1 104.59,16.51 v104.39,16.51 | J1.10 109.75,26.92 v112.01,26.92 | U3.10 94.71,66.8 v88.9,66.8
  Top 0.305: JP6.12 38.61,24.64 v38.35,24.89 | JP6.9 38.61,22.1 v38.35,22.35 | JP6.6 38.61,19.56 v38.35,19.81 | JP6.3 38.61,17.02 v38.1,17.53 | X1.11 66.55,65.79 | X1.11 65.15,67.06 v65.28,67.06 | X1.13 X1.11 | X1.14 X1.12 | X1.12 X1.10 | X1.12 65.41,61.72 v65.79,61.72 | X1.14 62.87,61.72 v62.99,61.72 | X1.13 61.34,67.18 v61.98,67.82 | X1.11 X1.12 | X1.13 X1.14
  Top 1.27: U$47.RING 15.71,64.3 v20.07,59.94 | U$47.RING_SW 5.08,58 v5.08,56.64
  pour Bottom: 0.51,70.61 4.06,74.17 6.86,74.17 112.27,74.17 115.06,71.37 115.06,2.29 109.22,-3.56 6.86,-3.56 0.25,3.05 0.25,70.36
GPIO4  (via drill 0.4)
  Top 0.152: J2.54 73.19,33.05 72.69,32.56 65.48,32.56 56.66,41.38 v47.5,41.38 | v39.88,64.52 39.88,64.64 X1.29
  Bottom 0.152: v47.5,41.38 39.88,49 v39.88,64.52
GPIO5  (via drill 0.4)
  Top 0.152: J2.34 77.19,37.11 77.47,36.83 77.47,32.01 74.93,29.46 63.25,29.46 v56.39,36.32 | v54.86,64.26 53.72,65.41 X1.19
  Bottom 0.152: v56.39,36.32 55.65,37.06 55.65,60.27 54.86,61.05 v54.86,64.26
GPIO6  (via drill 0.4)
  Top 0.152: v57.4,34.04 62.48,28.96 74.92,28.96 77.99,32.02 J2.30 | v58.42,61.47 58.42,62.87 X1.16
  Bottom 0.152: 56.39,59.44 v58.42,61.47
  Bottom 0.203: v57.4,34.04 57.2,34.24 57.2,36.66 56.39,37.47 56.39,59.44
GPIO14
  Top 0.152: J2.55 72.77,40.8 72.77,41.25 67.79,46.23 59.69,46.23 58.67,47.24 52.58,47.24 41.02,58.8 X1.30
GPIO15
  Top 0.152: J2.51 73.59,41.73 68.73,46.59 60.09,46.59 58.93,47.75 52.83,47.75 43.56,57.02 X1.28
GPIO16
  Top 0.152: J2.29 77.97,40.8 77.97,41.35 70.95,48.37 63.13,48.37 57.25,54.25 57.25,63.66 56.26,64.65 X1.17
GPIO17  (via drill 0.4)
  Top 0.152: J2.50 73.99,33.09 72.9,32 65.28,32 56.64,40.64 48.81,40.64 v48.77,40.6 | v42.42,64.52 42.42,64.64 X1.27
  Bottom 0.152: v48.77,40.6 48.28,41.08 48.28,41.7 42.42,47.57 v42.42,64.52
GPIO_VREF  (via drill 0.4)
  Top 0.203: J2.78 68.39,36.77 68.83,36.32 v70.61,36.32 | v94.23,35.31 96.14,33.4 JP7.2
  Bottom 0.203: v70.61,36.32 79.88,36.32 80.44,35.77 93.77,35.77 v94.23,35.31
I2C_LIDAR_SCL_0
  Top 0.152: J2.35 76.77,40.8 76.77,41.46 70.57,47.66 60.8,47.66 59.33,49.12 54.36,49.12 50.19,53.29 50.19,63.66 51.18,64.65 X1.21
I2C_LIDAR_SDA_0  (via drill 0.4)
  Top 0.152: 76.77,37.72 J2.36 76.79,37.01 77.06,36.73 77.06,32.11 74.93,29.97 64.01,29.97 56.64,37.34 v54.86,37.34 | v54.1,60.71 53.72,61.09 X1.20
  Bottom 0.152: v54.86,37.34 54.36,37.85 54.36,60.45 v54.1,60.71
N$1
  Top 0.203: LED1.C 36.06,55.76 R10.1
N$2
  Top 0.152: U3.1 88.23,49.14 C2.1
N$3
  Top 0.203: U3.12 108.71,65.64 108.71,67.06 106.17,69.6 87.19,69.6 R11.1
N$4
  Top 0.254: U3.13 110.17,52.79 R12.1
N$5
  Bottom 0.203: 113.03,67.06 113.03,3.05 109.22,-0.76 7.87,-0.76 2.03,5.08 2.03,59.44 2.03,59.94 2.03,68.83 4.83,71.63 108.46,71.63 113.03,67.06
N$6  (via drill 0.4)
  other vias: 39.12,12.45
N$7  (via drill 0.4)
  other vias: 43.43,28.7
N$8  (via drill 0.4)
  other vias: 38.1,27.94
N$9  (via drill 0.4)
  other vias: 38.1,48.01
N$10  (via drill 0.4)
  other vias: 32.77,53.85
N$11  (via drill 0.4)
  other vias: 19.05,56.39
N$12  (via drill 0.4)
  other vias: 18.8,67.31
N$13  (via drill 0.4)
  other vias: 20.83,64.77
N$14  (via drill 0.4)
  other vias: 3.81,63.25
N$15  (via drill 0.4)
  other vias: 4.06,52.83
N$16  (via drill 0.4)
  other vias: 8.38,53.34
N$17
  Top 0.254: T2.C 17.84,48.77 R19.2
N$18
  Top 0.152: R27.1 76.27,56.69 LED2.C
N$23
  Top 0.254: T2.B 25.78,46.35 R28.1
N$29  (via drill 0.4)
  other vias: 4.06,45.97
N$30  (via drill 0.4)
  other vias: 3.56,35.31
N$34
  Top 0.254: R19.1 12.19,48.9 M_OUT_1.1
N$38
  Top 0.254: 28.39,41.15 R29.1 25.78,41.02 T1.B
N$39
  Top 0.254: T1.C 18.22,43.18 R30.2
N$40
  Top 0.254: R30.1 12.19,43.56 M_OUT_2.1
N$44
  Top 0.254: T3.B 25.91,35.94 R31.1
N$48
  Top 0.254: T3.C 18.22,38.23 R32.2
N$49
  Top 0.254: M_OUT_3.1 R32.1
N$50
  Top 0.254: T4.B 26.04,30.73 R33.1
N$51
  Top 0.254: T4.C 18.22,33.15 R34.2
N$52
  Top 0.254: R34.1 M_OUT_4.1
N$53  (via drill 0.4)
  other vias: 4.57,24.89
N$54
  Top 0.254: T5.B 26.29,25.65 R35.1
N$55
  Top 0.254: T5.C 18.35,28.07 R36.2
N$57
  Top 0.254: R36.1 JP11.1
N$58
  Top 0.254: T6.B 26.8,19.94 R37.1
N$59
  Top 0.254: T6.C 18.22,22.86 R38.2
N$60  (via drill 0.4)
  other vias: 4.32,9.14
N$61
  Top 0.254: R38.1 12.45,22.99 JP12.1
N$62  (via drill 0.4)
  other vias: 32.77,13.97
N$63
  Top 0.254: T7.B 26.16,14.61 R39.1
N$64  (via drill 0.4)
  other vias: 61.21,26.92
N$65  (via drill 0.4)
  other vias: 73.15,26.67
N$66
  Top 0.254: T7.C 18.22,17.02 R40.2
N$67  (via drill 0.4)
  other vias: 83.31,33.02
N$69  (via drill 0.4)
  other vias: 93.98,37.85
N$71  (via drill 0.4)
  other vias: 103.63,35.05
N$73
  Top 0.254: R40.1 JP13.1
N$74
  Top 0.254: T8.B 26.29,9.14 R41.1
N$75  (via drill 0.4)
  other vias: 99.31,18.03
N$76
  Top 0.254: T8.C 18.6,11.56 R42.2
N$77  (via drill 0.4)
  other vias: 106.17,9.65
N$79  (via drill 0.4)
  other vias: 64.26,22.35
N$80  (via drill 0.4)
  other vias: 62.99,13.72
N$82
  Top 0.254: R42.1 12.45,11.94 JP14.1
N$87  (via drill 0.4)
  other vias: 75.44,16
N$88  (via drill 0.4)
  other vias: 50.04,4.32
N$89
  Top 0.254: T9.B 26.92,3.3 R43.1
N$91
  Top 0.254: T9.C R44.2
N$92  (via drill 0.4)
  other vias: 88.39,64.26
N$94
  Top 0.254: JP15.1 15.81,6.6 R44.1
N$95  (via drill 0.4)
  other vias: 88.39,53.85
N$96  (via drill 0.4)
  other vias: 101.35,44.2
N$97  (via drill 0.4)
  other vias: 72.14,58.42
N$98  (via drill 0.4)
  other vias: 51.56,19.81
N$103  (via drill 0.4)
  other vias: 87.88,2.29
N$104  (via drill 0.4)
  other vias: 59.94,4.32
N$109  (via drill 0.4)
  other vias: 81.53,43.94
N$120  (via drill 0.4)
  other vias: 56.64,31.75
N$122  (via drill 0.4)
  other vias: 51.56,36.58
N$124  (via drill 0.4)
  other vias: 52.83,53.34
OE
  Top 0.254: MOTOR_CONTROL.23 48.04,37.42 R7.1
PI_NLED_ACTIVITY
  Top 0.152: J2.21 79.59,51.16 R27.2
POWER  (via drill 0.4)
  Top 0.152: J2.99 62.61,42.16 v62.48,42.16 | v62.23,45.28 59.46,45.28 58.49,46.25 52.56,46.25 39.47,59.33 39.47,63.66 38.48,64.65 X1.31
  Bottom 0.152: v62.48,42.16 62.23,42.42 v62.23,45.28
PWM0
  Top 0.254: MOTOR_CONTROL.6 35.73,37.42 31.75,41.4 31.75,44.64 R28.2
PWM1
  Top 0.152: MOTOR_CONTROL.7 37.16,36.83
  Top 0.254: MOTOR_CONTROL.7 34.66,36.77 R29.2
PWM2
  Top 0.152: R31.2 30.47,36.12
  Top 0.254: 30.47,36.12 MOTOR_CONTROL.8
PWM3
  Top 0.254: MOTOR_CONTROL.9 33.44,35.47 30.41,32.45 R33.2
PWM4
  Top 0.254: MOTOR_CONTROL.10 33.81,34.82 31.75,32.77 31.75,27.12 R35.2
PWM5
  Top 0.254: MOTOR_CONTROL.11 34.43,34.17 32.77,32.51 32.77,22.55 R37.2
PWM6
  Top 0.254: MOTOR_CONTROL.12 35.06,33.52 35.05,33.53 33.53,32 33.53,17.97 R39.2
PWM7
  Top 0.254: MOTOR_CONTROL.13 35.41,32.87 34.29,31.75 34.29,13.15 R41.2
PWM8
  Top 0.254: MOTOR_CONTROL.15 43.05,31.37 42.67,30.99 36.58,30.99 35.05,29.46 35.05,8.07 R43.2
PWM9
  Top 0.254: MOTOR_CONTROL.16 43.83,32.87 45.59,31.11 JP6.10
PWM10
  Top 0.254: MOTOR_CONTROL.17 44.2,33.53 46.81,30.91 46.81,23.32 JP6.7
PWM11
  Top 0.254: MOTOR_CONTROL.18 44.57,34.17 47.27,31.47 47.27,21.24 JP6.4
PWM12
  Top 0.152: MOTOR_CONTROL.19 43.08,34.8
  Top 0.254: MOTOR_CONTROL.19 44.68,34.82 48.01,31.5 48.01,19.43 JP6.1
SCL
  Top 0.152: J2.56 72.79,33.42 72.29,32.92 65.64,32.92 56.39,42.16 46.23,42.16 45.06,41 45.06,40.24 44.19,39.37 MOTOR_CONTROL.26
  Top 0.203: MOTOR_CONTROL.26
SDA
  Top 0.152: J2.58 72.39,33.78 71.88,33.27 65.79,33.27 56.39,42.67 46.23,42.67 44.7,41.15 44.7,40.39 44.34,40.02 MOTOR_CONTROL.27
SPEAKER0
  Top 0.152: X1.18 56.26,52.7 60.95,48.02 70.8,48.02 77.57,41.25 77.57,40.8 J2.31
SPEAKER1  (via drill 0.4)
  Top 0.152: J2.28 78.39,31.65 75.18,28.45 61.72,28.45 v58.67,31.5 | v59.94,64.26 58.8,65.41 X1.15
  Bottom 0.203: v58.67,31.5 58.67,36.32 57.15,37.85 57.15,58.67 59.94,61.47 v59.94,64.26
SPI_ACCELEROMETER_CE0_N
  Top 0.152: J2.39 75.97,40.8 75.97,41.25 70.28,46.94 60.5,46.94 59.18,48.26 53.09,48.26 45.11,56.24 45.11,63.66 46.1,64.65 X1.25
SPI_ACCELEROMETER_CE1_N
  Top 0.152: J2.37 76.37,40.8 76.37,41.35 70.42,47.3 60.65,47.3 59.18,48.77 53.34,48.77 47.65,54.46 47.65,63.66 48.64,64.65 X1.23
SPI_ACCELEROMETER_MIS0  (via drill 0.4)
  Top 0.152: J2.40 75.99,36.79 76.2,36.58 76.2,32.77 74.68,31.24 64.52,31.24 56.69,39.07 v51.82,39.07 | v48.77,61.47 48.64,61.59 X1.24
  Bottom 0.152: v51.82,39.07 51.31,39.58 51.31,43.94 48.51,46.74 48.51,61.21 v48.77,61.47
SPI_ACCELEROMETER_MOS1  (via drill 0.4)
  Top 0.152: J2.44 75.19,36.83 75.69,36.32 75.69,33.02 74.32,31.65 64.87,31.65 56.66,39.86 v50.04,39.86 | v45.97,59.94 45.97,63.12 X1.26
  Bottom 0.152: v50.04,39.86 49.78,40.11 49.78,42.16 45.97,45.97 v45.97,59.94
SPI_ACCELEROMETER_SCLK  (via drill 0.4)
  Top 0.152: 76.37,37.72 J2.38 76.39,36.9 76.71,36.58 76.71,32.51 74.93,30.73 64.26,30.73 56.71,38.29 v53.34,38.29 | v51.05,60.96 51.05,63.12 X1.22
  Bottom 0.152: v53.34,38.29 52.83,38.8 52.83,46.48 51.05,48.26 v51.05,60.96

### Text on the board
tPlace: 5V | 3.3V | 3.3V | 3.3V | 3.3V | GPIO4 | GPIO17 | SPI / CE0_N | SPI / CE1_N | Lidar / SCL_0 | GPIO5 | GPIO16 | SPEAKER1 | GND | GND | GND | GND | GND | GND | GND | 5V | GND | GND | GND | GND | GND | 3.3V | 3.3V | 3.3V | 3.3V | GPIO14 | GPIO15 | SPI / MOS1 | SPI / MIS0 | SPI / SCLK | Lidar / SDA_0 | GPIO6 | GND | GND | SPEAKER0 | 0 | 1 | 2 | 3 | 4 | GND | 5V | PWM | 9 | 5 | 10 | 11 | 6 | 12 | 7 | 8 | EEL4915L_CMB-22Spring 00116 / Depth Perception Haptic System (DPHS) / Group 40 | Group Members: / Christa Lawrence - Computer Engineering / Cristopher Matos - Computer Engineering / Kathryn Pagano - Electrical Engineering / Chad Pauley - Electrical Engineering